# Altium schematic sheet LCD_RGB.SchDoc: main_assy PCB
size A4
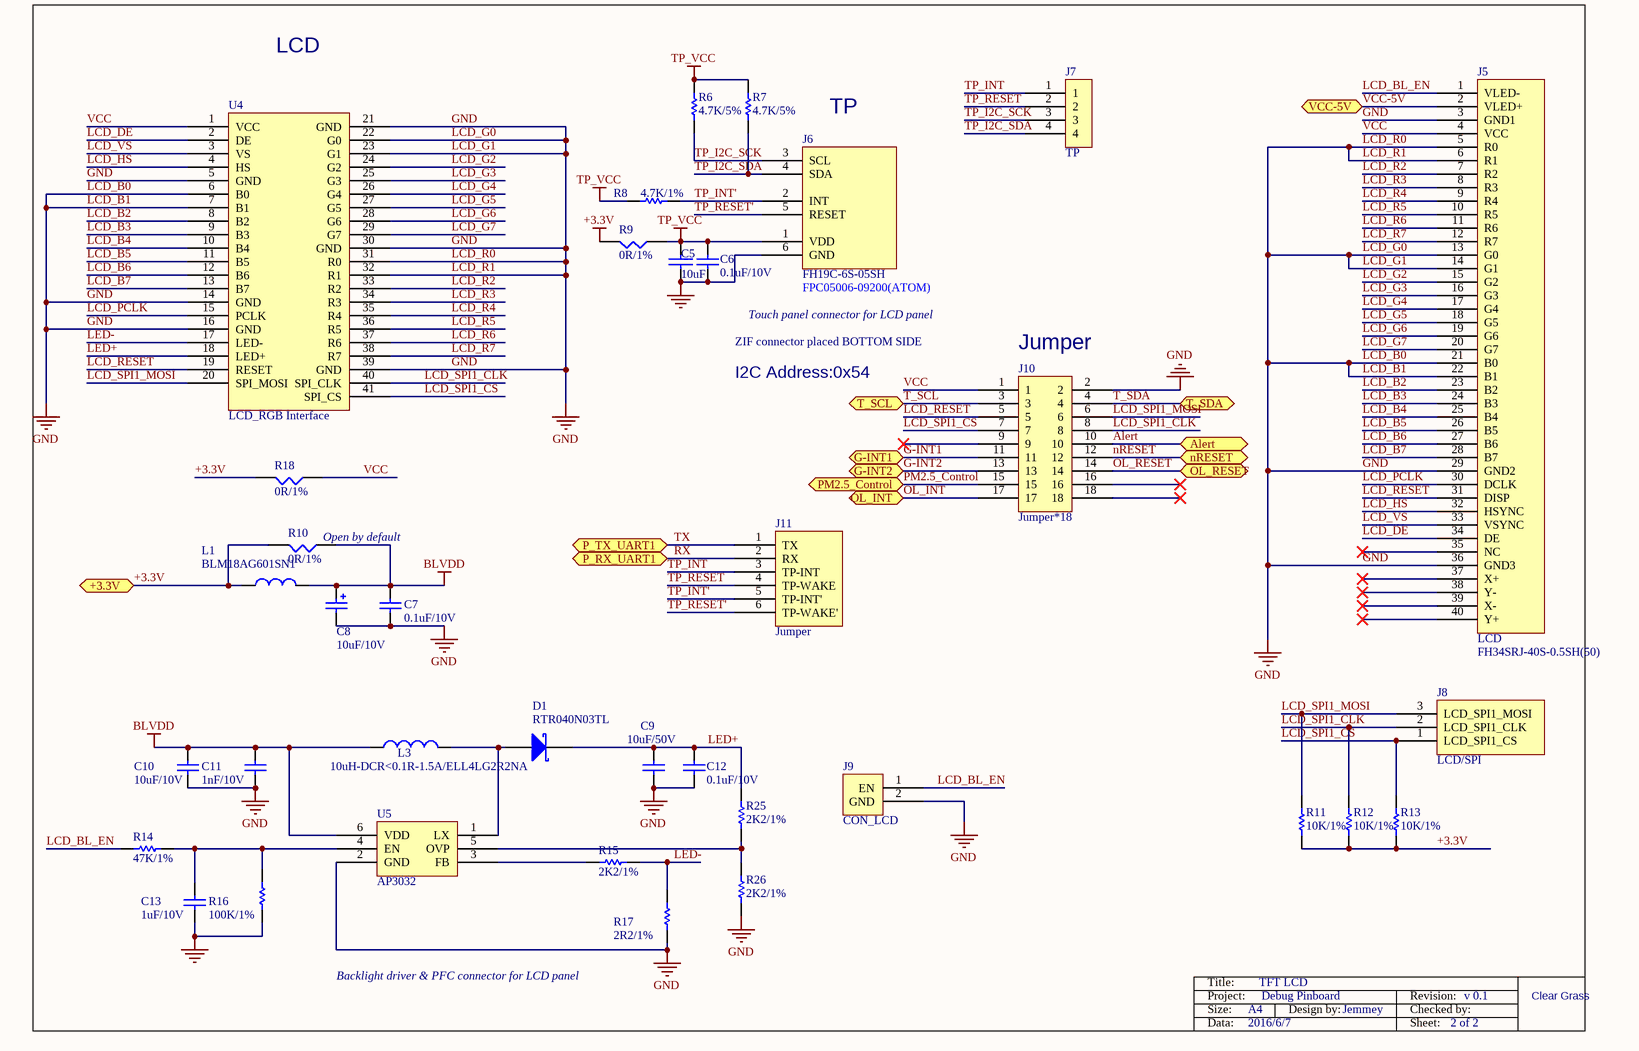
[diagram p0: LCD_RGB.SchDoc]

## Parts
C5  10uF  [0603C]
C6  0.1uF/10V  [0402C]
C7  0.1uF/10V  [0402C]
C8  10uF/10V  [0603C]
C9  10uF/50V  [0603C]
C10  10uF/10V  [0603C]
C11  1nF/10V  [0402C]
C12  0.1uF/10V  [0402C]
C13  1uF/10V  [0402C]
D1  RTR040N03TL  [TUMD2M]
J5  LCD  [FPC_CON40-BACK-IRS]
J6  FH19C-6S-05SH  [FPC_CON6-BACK-MOLEX]
J7  TP  [FPC_CON4-1MM-MOLEX]
J8  LCD/SPI  [2.54*3]
J9  CON_LCD  [2.54*2]
J10  Jumper*18  [2.54*18]
J11  Jumper  [2.54*2 *3]
L1  BLM18AG601SN1  [0603R]
L3  10uH-DCR<0.1R-1.5A/ELL4LG2R2NA  [INDM4040X18N]
R6  4.7K/5%  [0402R]
R7  4.7K/5%  [0402R]
R8  4.7K/1%  [0402R]
R9  0R/1%  [0603R]
R10  0R/1%  [0603R]
R11  10K/1%  [0402R]
R12  10K/1%  [0402R]
R13  10K/1%  [0402R]
R14  47K/1%  [0402R]
R15  2K2/1%  [0402R]
R16  100K/1%  [0402R]
R17  2R2/1%  [0402R]
R18  0R/1%  [0603R]
R25  2K2/1%  [0402R]
R26  2K2/1%  [0402R]
U4  LCD_RGB Interface  [FPC_CON41-0.3MM-HRS]
U5  AP3032  [SOT23-6-L]

## Ports
+3.3V, Alert, G-INT1, G-INT2, nRESET, OL_INT, OL_RESET, P_RX_UART1, P_TX_UART1, PM2.5_Control, T_SCL, T_SDA, VCC-5V

## Nets
+3.3V: L1.1 R9.2 R10.2 R11.1 R12.1 R13.1 R18.2 ; port +3.3V
BLVDD: C7.1 C8.1 C10.2 C11.2 L1.2 L3.1 R10.1 U5.6(VDD)
GND: C5.1 C6.1 C7.2 C8.2 C9.2 C10.1 C11.1 C12.1 C13.1 J5.3(GND1) J5.5(R0) J5.6(R1) J5.13(G0) J5.14(G1) J5.21(B0) J5.22(B1) J5.29(GND2) J5.36(GND3) J6.6(GND) J9.2(GND) J10.2 R16.2 R17.2 R26.1 U4.5(GND) U4.6(B0) U4.7(B1) U4.14(GND) U4.16(GND) U4.21(GND) U4.22(G0) U4.23(G1) U4.30(GND) U4.31(R0) U4.32(R1) U4.39(GND) U5.2(GND)  [also labelled LCD_B0, LCD_B1, LCD_G0, LCD_G1, LCD_R0, LCD_R1]
TP_VCC: C5.2 C6.2 J6.1(VDD) R6.2 R7.2 R8.1 R9.1
Alert: J10.10 ; port Alert
G-INT1: J10.11 ; port G-INT1
G-INT2: J10.13 ; port G-INT2
LCD_B2: J5.23(B2) U4.8(B2)
LCD_B3: J5.24(B3) U4.9(B3)
LCD_B4: J5.25(B4) U4.10(B4)
LCD_B5: J5.26(B5) U4.11(B5)
LCD_B6: J5.27(B6) U4.12(B6)
LCD_B7: J5.28(B7) U4.13(B7)
LCD_BL_EN: J5.1(VLED-) J9.1(EN) R14.1
LCD_DE: J5.34(DE) U4.2(DE)
LCD_G2: J5.15(G2) U4.24(G2)
LCD_G3: J5.16(G3) U4.25(G3)
LCD_G4: J5.17(G4) U4.26(G4)
LCD_G5: J5.18(G5) U4.27(G5)
LCD_G6: J5.19(G6) U4.28(G6)
LCD_G7: J5.20(G7) U4.29(G7)
LCD_HS: J5.32(HSYNC) U4.4(HS)
LCD_PCLK: J5.30(DCLK) U4.15(PCLK)
LCD_R2: J5.7(R2) U4.33(R2)
LCD_R3: J5.8(R3) U4.34(R3)
LCD_R4: J5.9(R4) U4.35(R4)
LCD_R5: J5.10(R5) U4.36(R5)
LCD_R6: J5.11(R6) U4.37(R6)
LCD_R7: J5.12(R7) U4.38(R7)
LCD_RESET: J5.31(DISP) J10.5 U4.19(RESET)
LCD_SPI1_CLK: J8.2(LCD_SPI1_CLK) J10.8 R12.2 U4.40(SPI_CLK)
LCD_SPI1_CS: J8.1(LCD_SPI1_CS) J10.7 R13.2 U4.41(SPI_CS)
LCD_SPI1_MOSI: J8.3(LCD_SPI1_MOSI) J10.6 R11.2 U4.20(SPI_MOSI)
LCD_VS: J5.33(VSYNC) U4.3(VS)
LED+: C9.1 C12.2 D1.2(K) R25.2 U4.18(LED+)
LED-: R15.2 R17.1 U4.17(LED-)
nRESET: J10.12 ; port nRESET
OL_INT: J10.17 ; port OL_INT
OL_RESET: J10.14 ; port OL_RESET
PM2.5_Control: J10.15 ; port PM2.5_Control
RX: J11.2(RX) ; port P_RX_UART1
T_SCL: J10.3 ; port T_SCL
T_SDA: J10.4 ; port T_SDA
TP_I2C_SCK: J6.3(SCL) J7.3 R6.1
TP_I2C_SDA: J6.4(SDA) J7.4 R7.1
TP_INT: J7.1 J11.3(TP-INT)
TP_INT': J6.2(INT) J11.5(TP-INT') R8.2
TP_RESET: J7.2 J11.4(TP-WAKE)
TP_RESET': J6.5(RESET) J11.6(TP-WAKE')
TX: J11.1(TX) ; port P_TX_UART1
VCC: J5.4(VCC) J10.1 R18.1 U4.1(VCC)
VCC-5V: J5.2(VLED+) ; port VCC-5V
NetC13_2: C13.2 R14.2 R16.1 U5.4(EN)
NetD1_1: D1.1(A) L3.2 U5.1(LX)
NetR15_1: R15.1 U5.3(FB)
NetR25_1: R25.1 R26.2 U5.5(OVP)

Not connected (* = marked no-connect by the designer): J5 35(NC)* 37(X+)* 38(Y-)* 39(X-)* 40(Y+)*; J10 9* 16* 18*

## Notes on the sheet
- LCD
- (near J6) TP
- (near J6) FPC05006-09200(ATOM)
- I2C Address:0x54
- ZIF connector placed BOTTOM SIDE
- Touch panel connector for LCD panel
- (near J10) Jumper
- (near R10) Open by default
- (near J5) FH34SRJ-40S-0.5SH(50)
- Backlight driver & PFC connector for LCD panel
- Title:
- TFT LCD
- Project:
- Size:
- Data:
- A4
- 2016/6/7
- Debug Pinboard
- Design by:
- Jemmey
- Revision:
- Sheet:
- Checked by:
- 2 of 2
- v 0.1
- Clear Grass

## Library data of the parts
C5 = CAP: 厂家：Murata，型号：GRM1555C1H120JA01D
C6 C10 C11 C13 = CAP: Capacitor; Value: 100pF; Ordered by: Subcon; Published: 8-Jun-2000; Revision: July-2002: Re-released for DXP Platform.; Publisher: Altium Limited
C7 = Cap: Capacitor; Value: 10nF; Ordered by: Subcon; Published: 8-Jun-2000; Revision: July-2002: Re-released for DXP Platform.; Publisher: Altium Limited
C8 = Cap Pol1: Polarized Capacitor (Radial); Value: 10uF; Ordered by: Subcon; Published: 8-Jun-2000; Revision: July-2002: Re-released for DXP Platform.; Publisher: Altium Limited
C9 C12 = CAP: 厂家：Murata，型号：; Value: 100pF; Ordered by: Subcon; Published: 8-Jun-2000; Revision: July-2002: Re-released for DXP Platform.; Publisher: Altium Limited
D1 = D Schottky: Schottky Diode; Manuf_Part_1: STPS1L40M; Code - JEDEC: DO-214-AA; Ordered by: ST; Ref St: 9151085; ECCN_US/EU: EAR99/NEC; Published: 8-Jun-2000; Revision: July-2002: Re-released for DXP Platform.; Publisher: Altium Limited; Manuf_1: ST
J5 = FPC60_1
J6 = FH19C-6S-05SH: ZIF connector placed bottom side; Manuf_1: ATOM; Manuf_2: Hirose; Manuf_Part_1: FPC05006-09200; Ordered by: Subcon; Silkscreen: TS; Manuf_Part_2: FH19C-6S-05SH
J7 = Jumper_uart: Jumper
J8 = Jumper
J11 = Jumper_uart
L1 = CHOKE: 厂家：MURATA，型号：BLM18AG601SN1
L3 = Inductor: Value: 100uH; Ordered by: Subcon; Published: 8-Jun-2000; Revision: July-2002: Re-released for DXP Platform.; Publisher: Altium Limited
R6-R8 R11-R13 = Res1: 厂家：Yageo，型号：; Value: 1K; Ordered by: Subcon; Published: 8-Jun-2000; Revision: July-2002: Re-released for DXP Platform.; Publisher: Altium Limited
R9 R10 R18 = RES1: 厂家：Yageo，型号：RC0402FR-070RL
R14-R17 R25 R26 = Res1: Resistor; Value: 1K; Ordered by: Subcon; Published: 8-Jun-2000; Revision: July-2002: Re-released for DXP Platform.; Publisher: Altium Limited
U5 = AP3032: Manuf_Part_1: STLD40DPUR; Ordered by: ST; Ref St: 9176009; ECCN_US/EU: EAR99/NEC; Manuf_1: ST